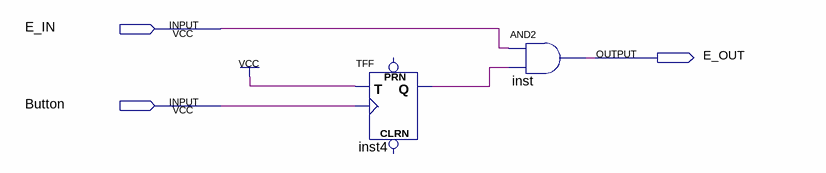
[diagram p0: schematic sheet]
// Quartus schematic enable.bdf as structural Verilog: 2 symbols, 3 pins
module enable (
  input  E_IN,
  input  Button,
  output E_OUT
);

  wire inst4_q;

  TFF inst4 (.T(1'b1), .CLK(Button), .Q(inst4_q));  // open: PRN, CLRN
  and inst (E_OUT, E_IN, inst4_q);
endmodule
